# EasyEDA Pro project ProPrj_Gochizo_V2.4.epro

# Schematic Schematic

## Sheets
1 MCU: Board Name: Gochizo; Create Date: 2024-09-22
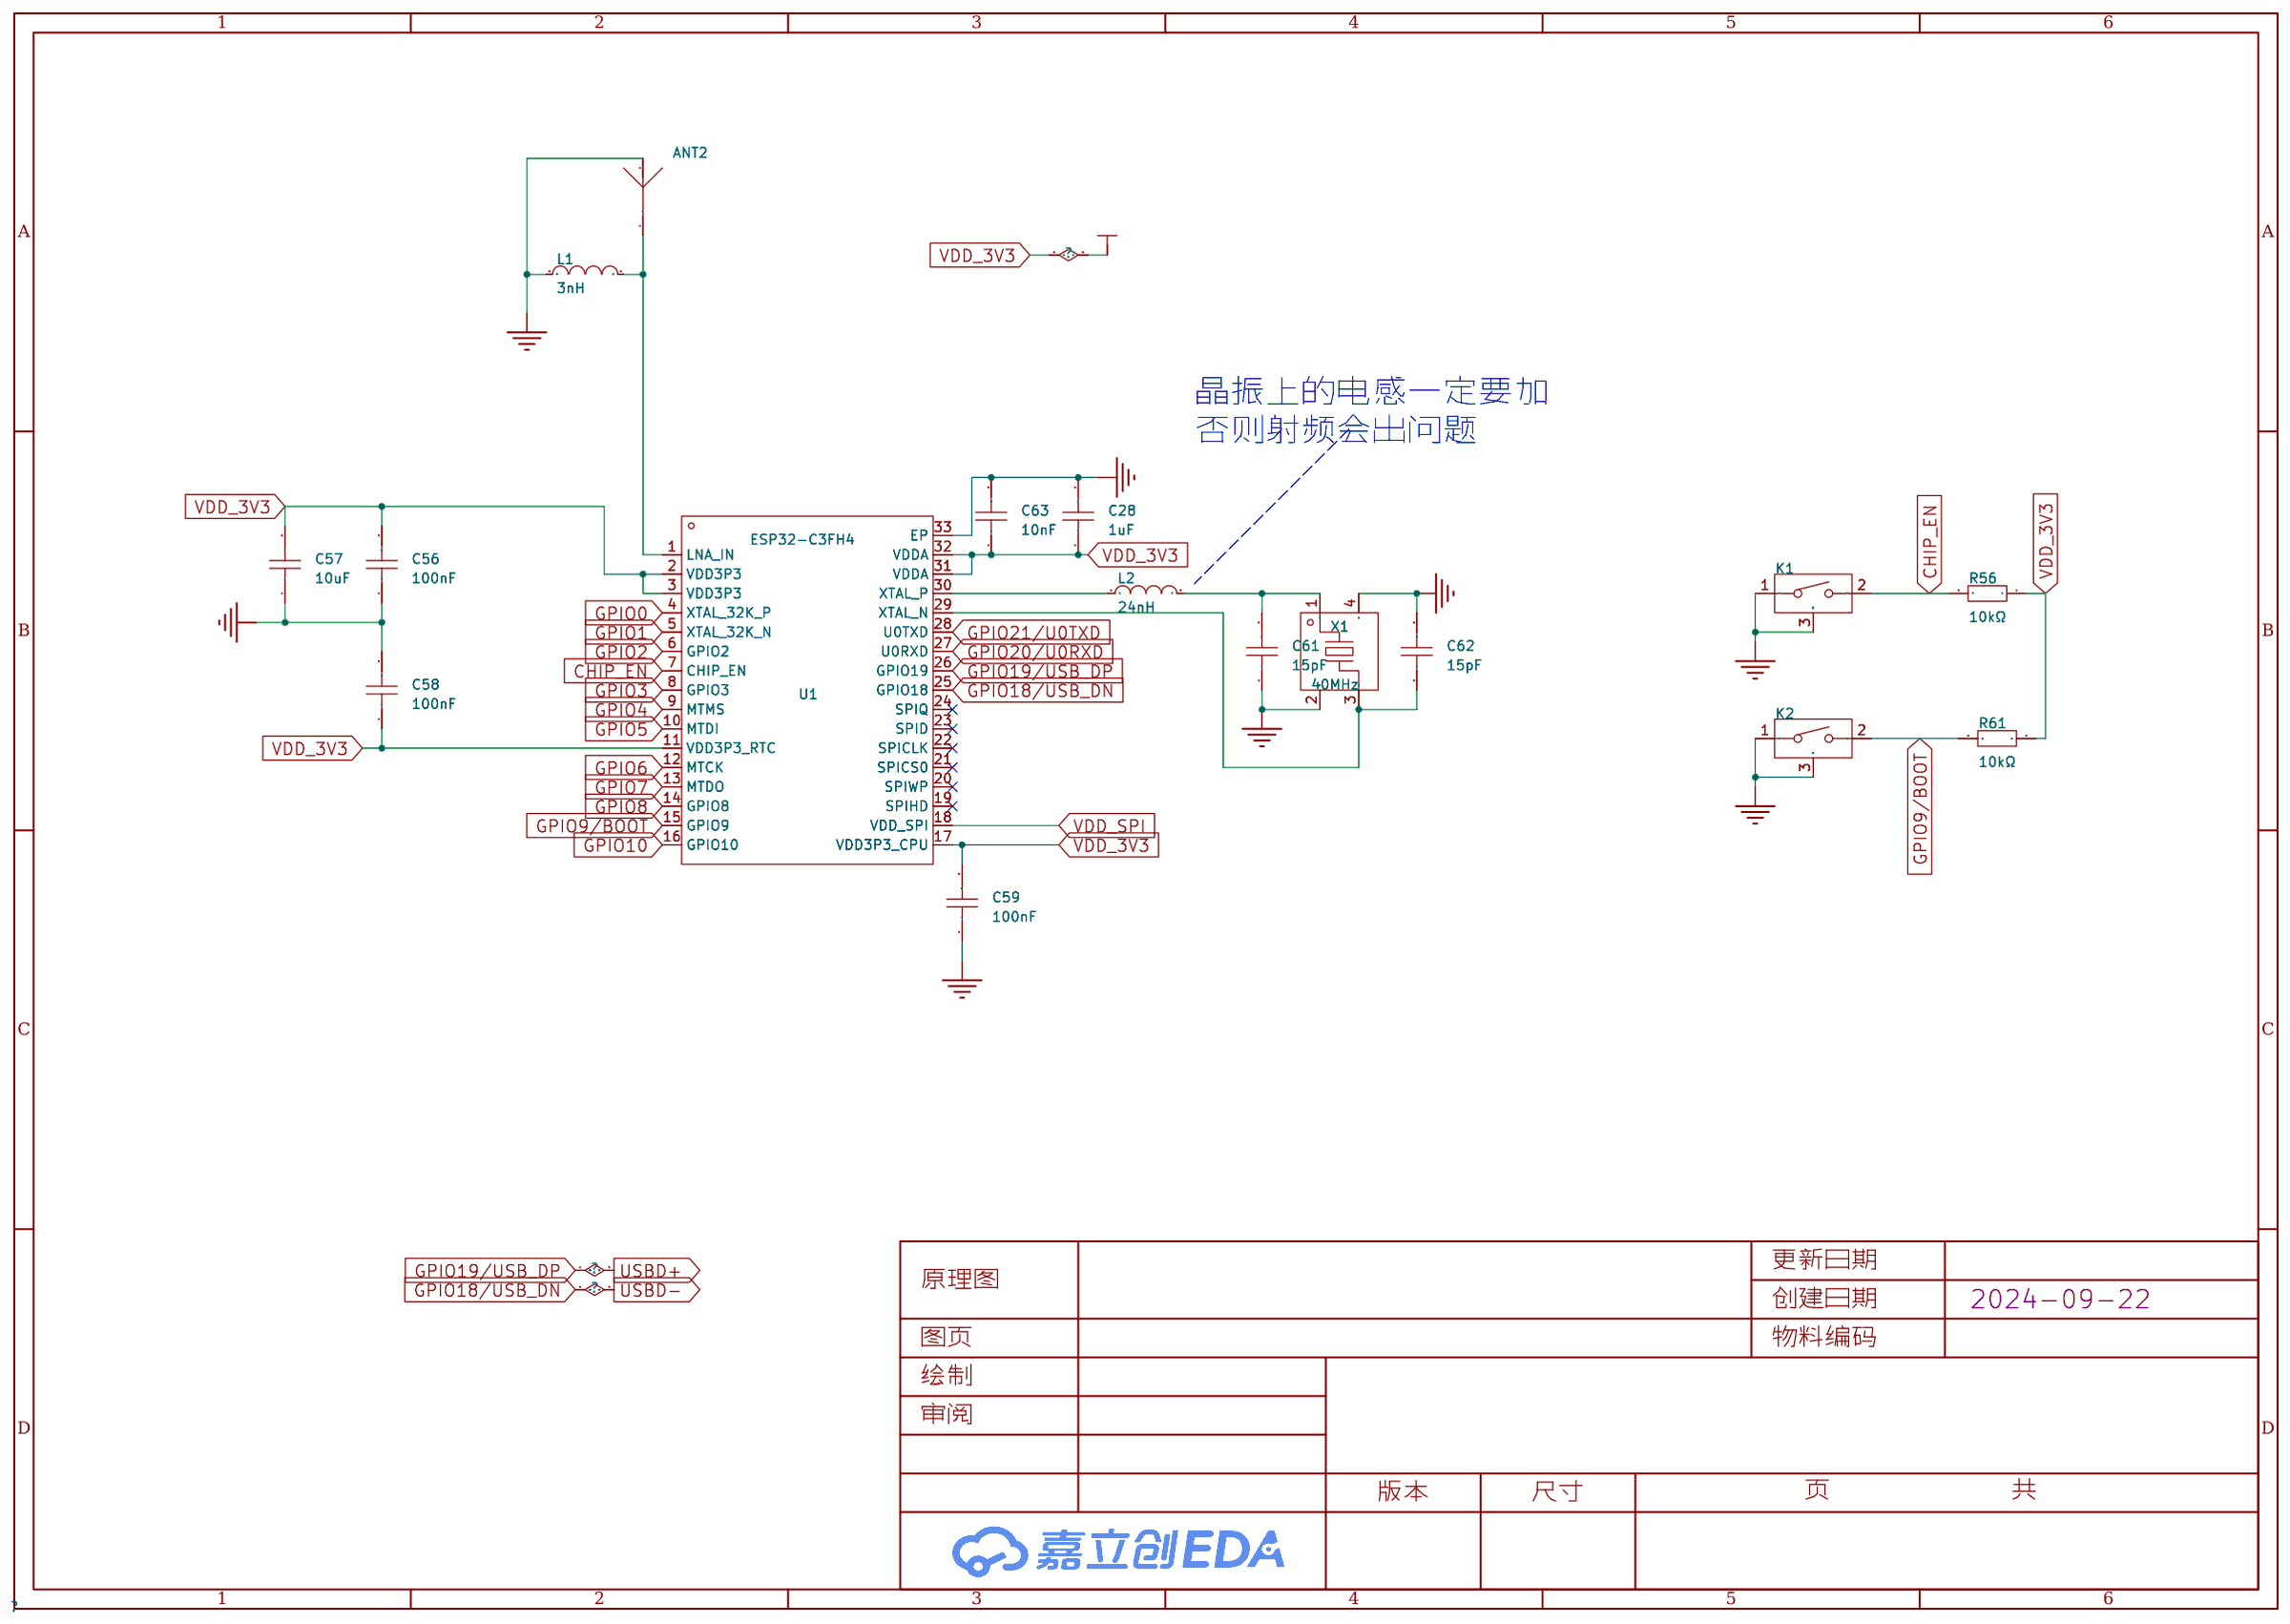
[diagram p0: MCU]
2 PWR
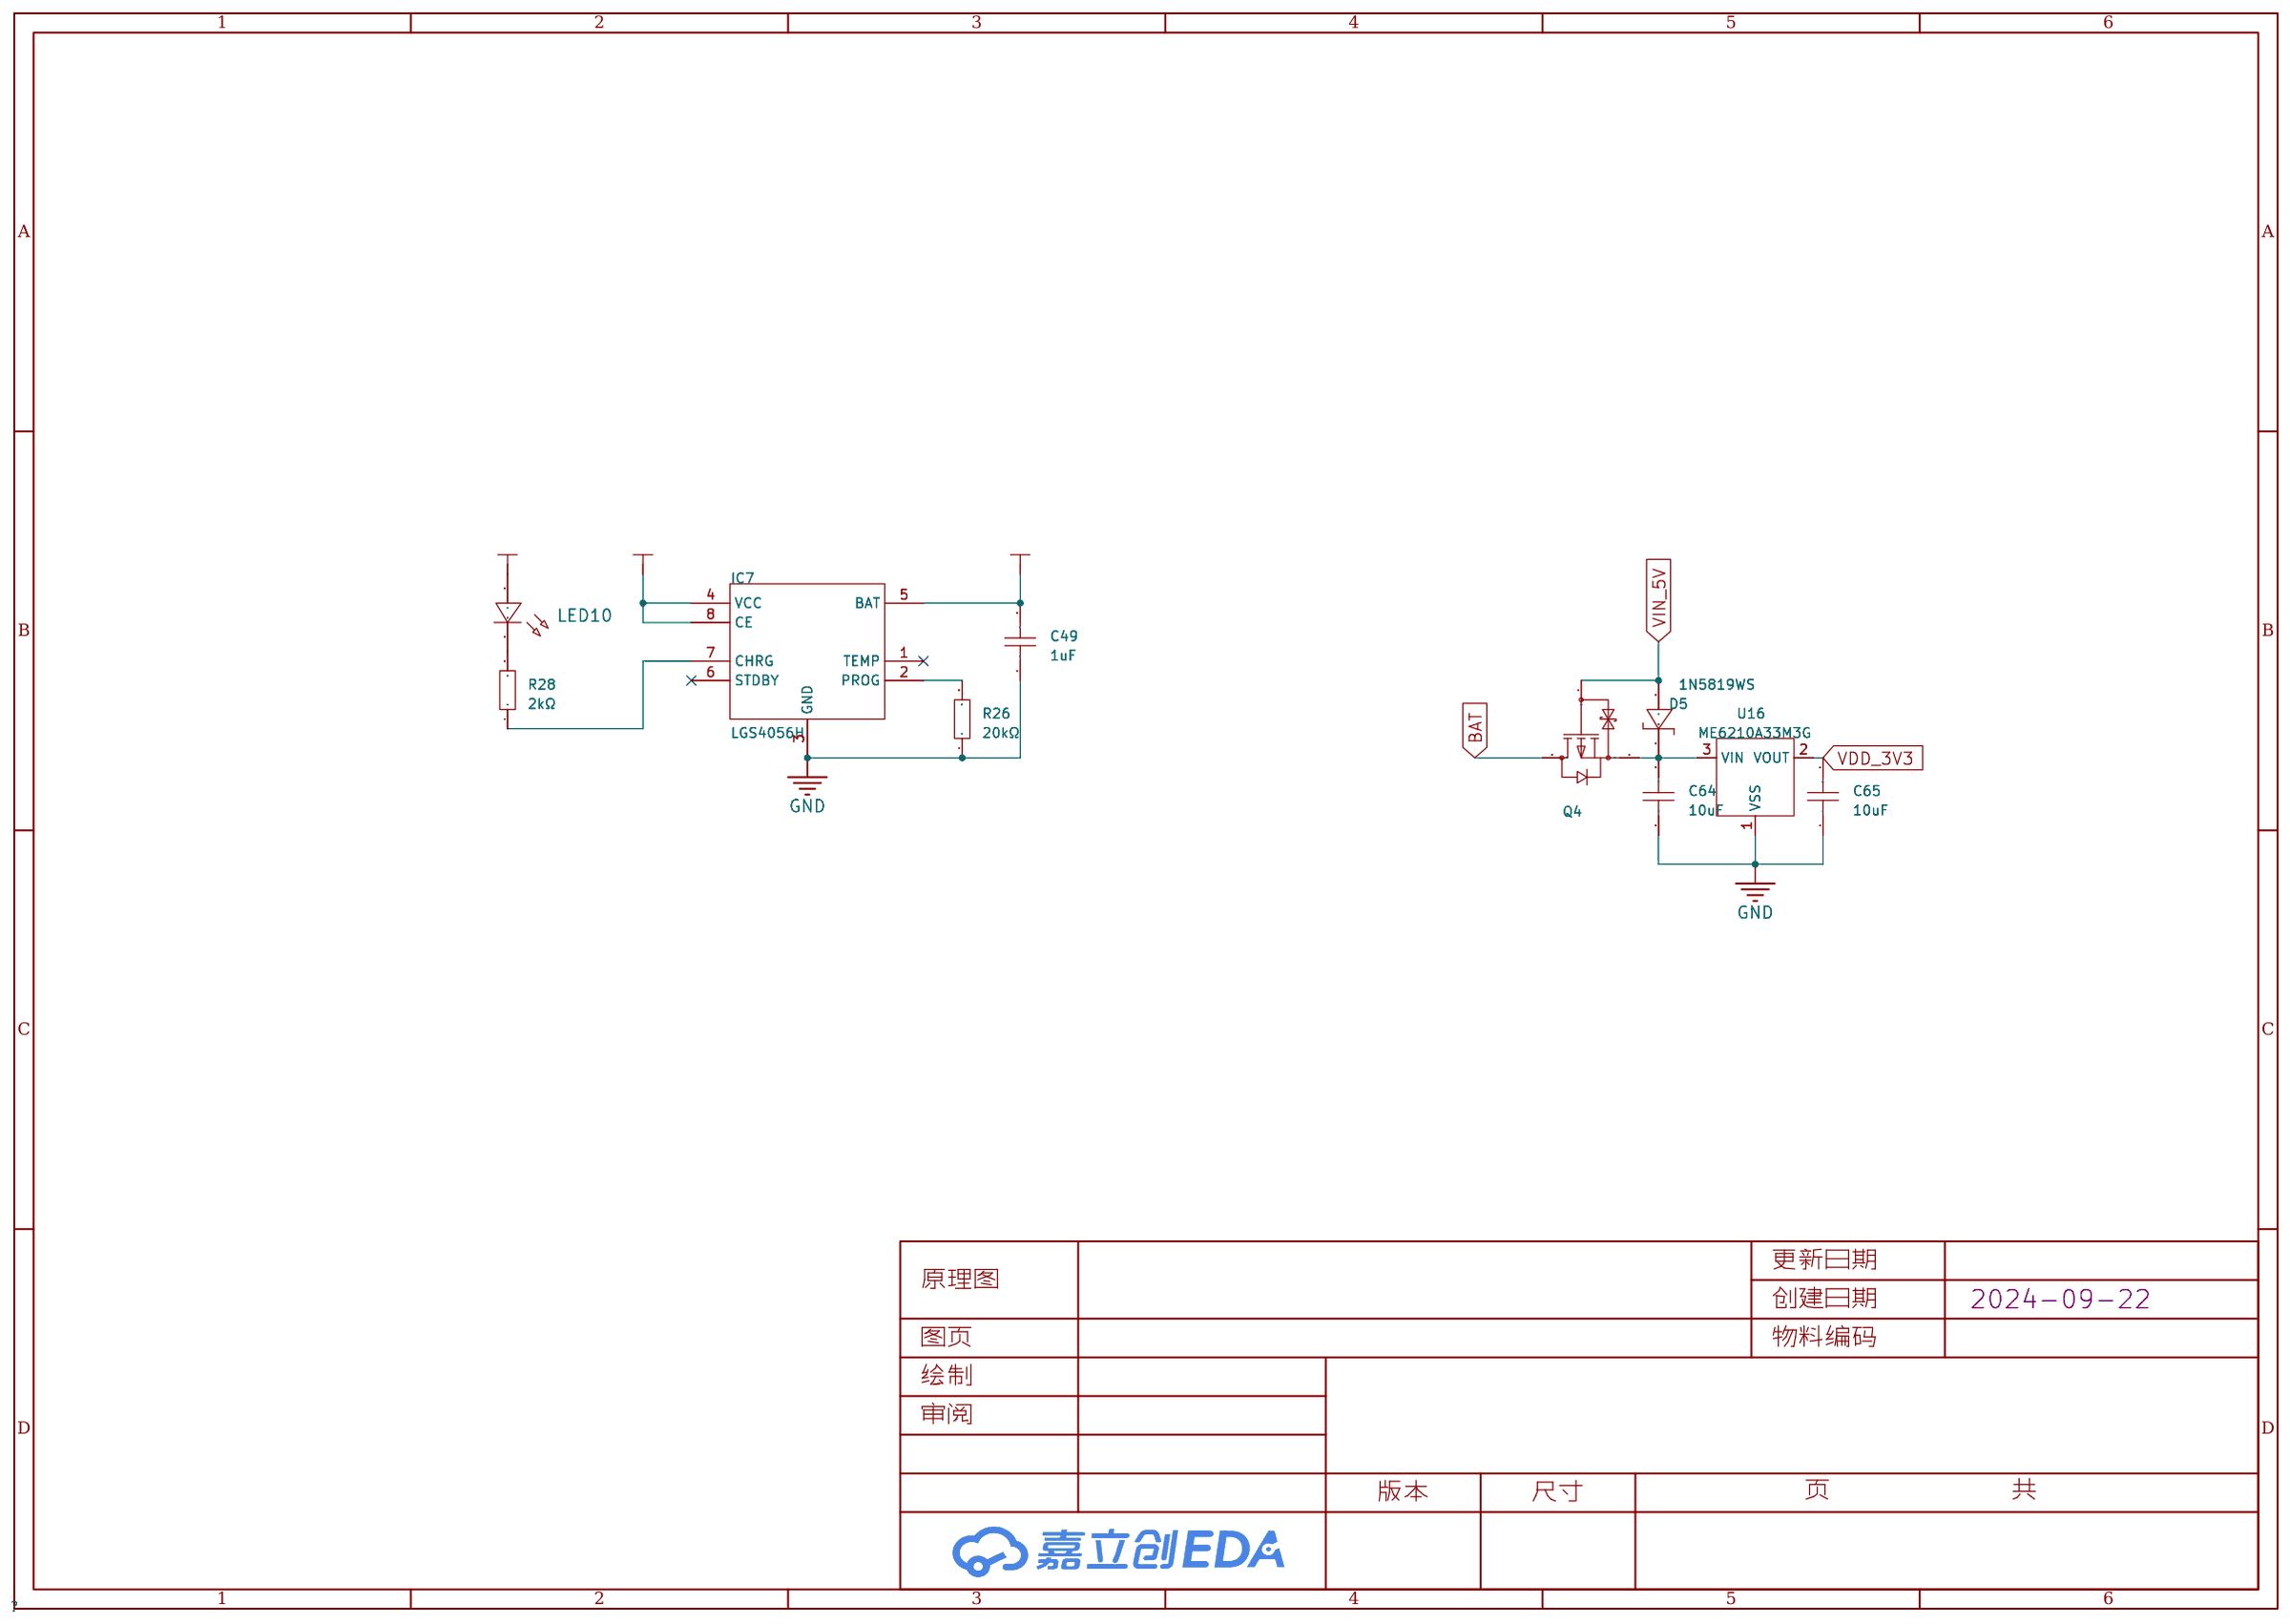
[diagram p1: PWR]
3 USER
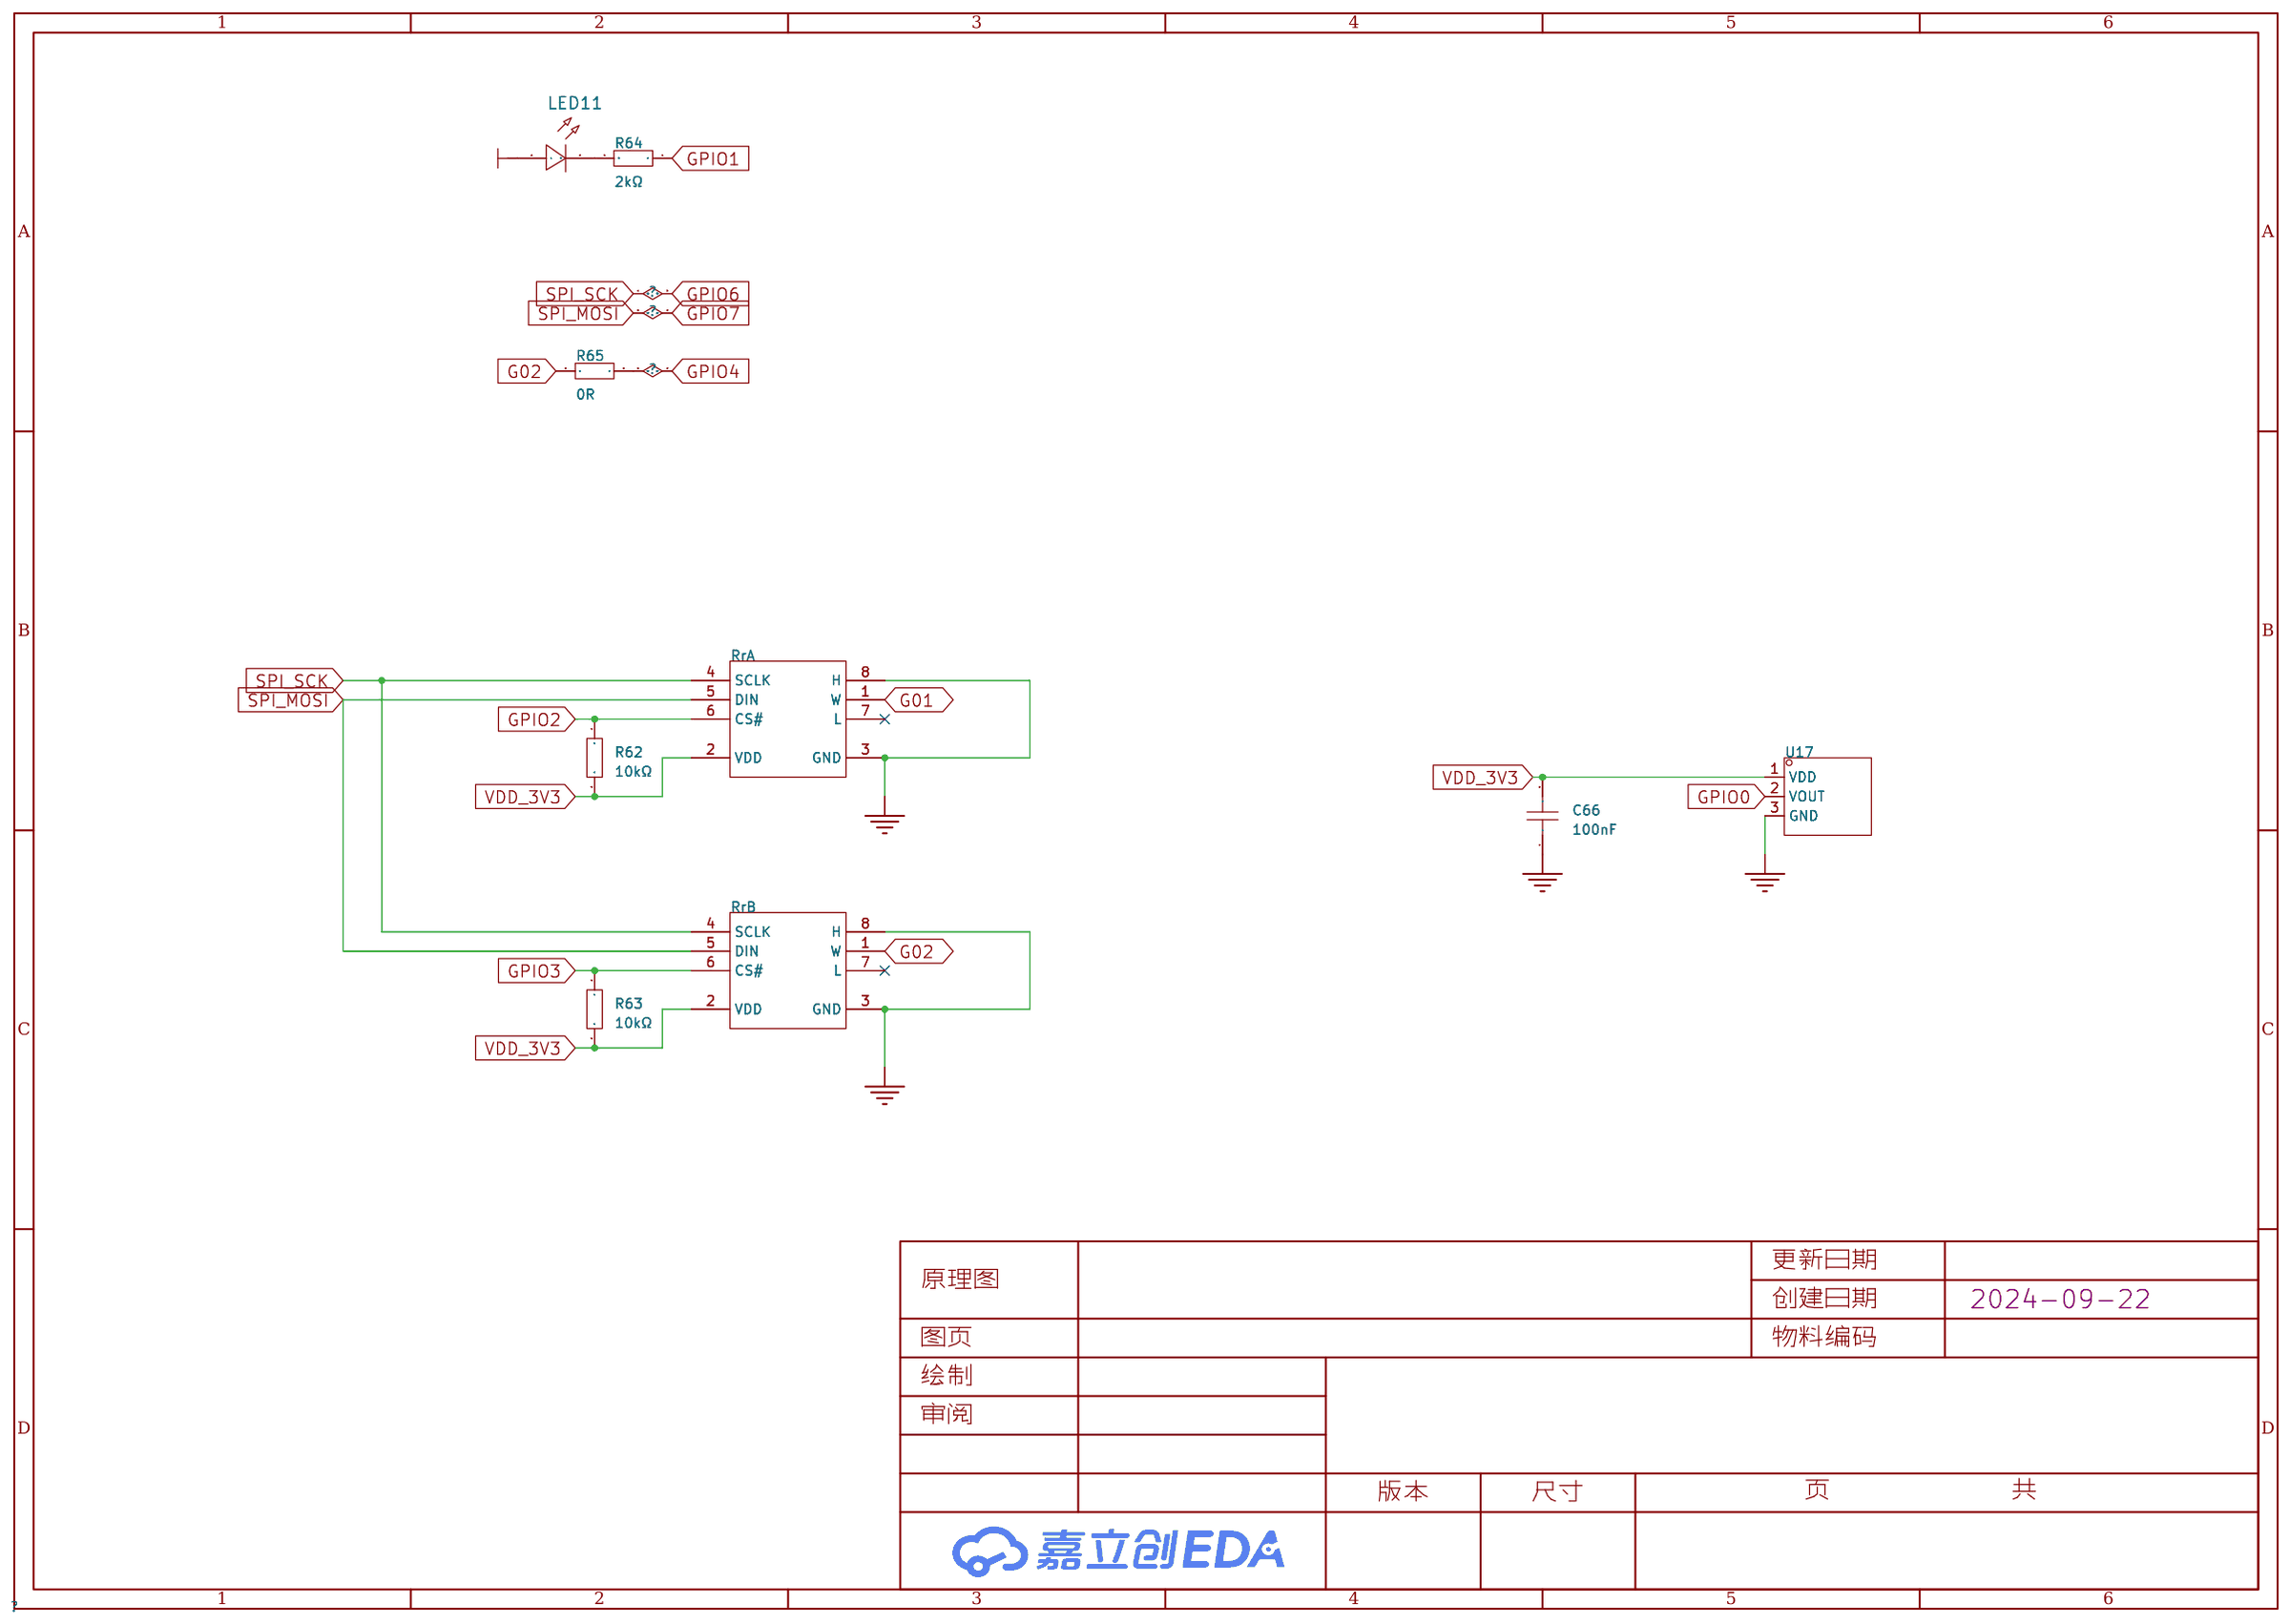
[diagram p2: USER]

## Parts
sheet MCU
ANT2  -  [ANT-SMD_L3.2-W1.6_CA-C01]
C28  1uF  [C0402]
C56  100nF  [C0402]
C57  10uF  [C0402]
C58  100nF  [C0402]
C59  100nF  [C0402]
C61  15pF  [C0402]
C62  15pF  [C0402]
C63  10nF  [C0402]
K1  TS3819ZJ 160gf  [KEY-SMD_TS3819ZJ]
K2  TS3819ZJ 160gf  [KEY-SMD_TS3819ZJ]
L1  3nH  [L0201]
L2  24nH  [IND-SMD_L1.0-W0.5-2]
R56  10kΩ  [R0402]
R61  10kΩ  [R0402]
U1  ESP32-C3FH4  [QFN-32_L5.0-W5.0-P0.50-TL-EP3.7]
X1  40MHz  [CRYSTAL-SMD_4P-L2.0-W1.6-BL]
sheet PWR
C49  1uF  [C0402]
C64  10uF  [C0402]
C65  10uF  [C0402]
D5  1N5819WS  [sod-323_l1.8-w1.3-ls2.5-rd]
IC7  LGS4056H  [DFN-8_L2.0-W2.0-P0.50-TL-EP]
LED10  LED0402-红色  [LED0402-RD_RED]
Q4  CJE3139K  [SC-75-3_L1.6-W0.8-P1.00-LS1.7-BR]
R26  20kΩ  [R0402]
R28  2kΩ  [R0402]
U16  ME6210A33M3G  [SOT-23-3_L3.0-W1.7-P0.95-LS2.9-BR]
sheet USER
C66  100nF  [C0402]
LED11  LED0402-红色  [LED0402-RD_RED]
R62  10kΩ  [R0402]
R63  10kΩ  [R0402]
R64  2kΩ  [R0402]
R65  0R  [R0402]
RrA  TPL0501-100DCNR  [SOT-23-8_L3.0-W1.7-P0.65-LS2.8-BL]
RrB  TPL0501-100DCNR  [SOT-23-8_L3.0-W1.7-P0.65-LS2.8-BL]
U17  CC6201ST  [SOT-23-3_L2.9-W1.3-P1.90-LS2.4-BR]

## Library data of the parts
ANT2 = CA-C01: Supplier Part: C9900018999; Supplier Footprint: SMD_3.2x1.6x0.4mm; JLCPCB Part Class: ExtendedPart; Datasheet: https://atta.szlcsc.comnull; Supplier: LCSC
C28 C56-C59 C61-C66 = CL05B104KB54PNC: 容值:100nF;精度:±10%;额定电压:50V;材质(温度系数):X7R;; LCSC Part Name: 100nF ±10% 50V; Supplier Part: C307331; Manufacturer: SAMSUNG(三星); Supplier Footprint: 0402; JLCPCB Part Class: 基础库; Datasheet: https://atta.szlcsc.com/upload/public/pdf/source/20181009/C307331_222F7C870FD3EA5F46F538B483443886.pdf; Supplier: LCSC; Tolerance: ±10%; Voltage Rated: 50V; Temperature Coefficient: X7R
K1 K2 = TS3819ZJ 160gf: 电路结构:单刀单掷;按钮形状:圆形按钮;作用力:1.6N;安装方式:卧贴;开关长度:3.9mm;开关宽度:2.9mm;开关高度:1.6mm;带支架:不带;触点电流:50mA;额定电压(DC):12V;绝缘电阻:100MΩ;带灯:无;机械寿命:50万次;; LCSC Part Name: 3.9*2.9*1.6mm 侧贴 3.8*1.9支架; Supplier Part: C6386917; Manufacturer: SHOU HAN(首韩); Supplier Footprint: SMD; JLCPCB Part Class: 扩展库; Datasheet: https://atta.szlcsc.com/upload/public/pdf/source/20230523/2451218DE4EE3321D1269CDEBC6584AD.pdf; Supplier: LCSC; Circuit: 单刀单掷; Actuator Style: 圆形按钮; Operating Force: 1.6N; Mounting Style: 卧贴; Switch Length: 3.9mm; Switch Width: 2.9mm; Switch Height: 1.6mm; Strike Gundam: 不带; Contact Current: 50mA; Voltage Rating (DC): 12V; Insulation Resistance: 100MΩ; Actuator/Cap Color: 白色; With Lamp: 无; Mechanical Life: 50万次; Operating Temperature: -30℃~+85℃
L1 = LQP03TN3N0B02D: 电感值:3nH;额定电流:-;饱和电流(Isat):-;直流电阻(DCR):250mΩ;; LCSC Part Name: 3nH ±0.1nH; Supplier Part: C98044; Manufacturer: muRata(村田); Supplier Footprint: 0201; JLCPCB Part Class: Extended Part; Datasheet: https://atta.szlcsc.com/upload/public/pdf/source/20170310/1489116404591.pdf; Supplier: LCSC; DC Resistance (DCR): 250mΩ; Q @ Freq: 14@500MHz; Frequency - Self Resonant: 9.5GHz
L2 = LQW15AN24NG80D: 电感值:24nH;精度:±2%;额定电流:770mA;饱和电流(Isat):-;; LCSC Part Name: 24nH ±2%; Supplier Part: C668462; Manufacturer: muRata(村田); Supplier Footprint: 0402; JLCPCB Part Class: 扩展库; Datasheet: https://atta.szlcsc.com/upload/public/pdf/source/20201228/C668462_EF8FB8FB445A38E861DA03D3842BC057.pdf; Supplier: LCSC; Tolerance: ±2%; Rated Current: 770mA; DC Resistance (DCR): 212mΩ
R56 R61-R63 R65 = 0402WGF1002TCE: 阻值:10kΩ;精度:±1%;功率:62.5mW;温度系数:±100ppm/℃;电阻类型:厚膜电阻;; LCSC Part Name: 10kΩ ±1% 62.5mW 厚膜电阻; Supplier Part: C25744; Manufacturer: UNI-ROYAL(厚声); Supplier Footprint: 0402; JLCPCB Part Class: Basic Part; Datasheet: https://atta.szlcsc.com/upload/public/pdf/source/20200306/C422600_1E6D84923E4A46A82E41ADD87F860B5C.pdf; Supplier: LCSC; Tolerance: ±1%; Power(Watts): 62.5mW; Overload Voltage (Max): 50V; Temperature Coefficient: ±100ppm/℃; Type: 厚膜电阻; Operating Temperature Range: -55℃~+155℃
U1 = ESP32-C3FH4: Supplier Part: C2858491; Manufacturer: ESPRESSIF(乐鑫); Supplier Footprint: QFN-32; JLCPCB Part Class: Extended Part; Datasheet: https://atta.szlcsc.com/upload/public/pdf/source/20210726/B8823F05EB5B1ECA99D4F01661A43FA8.pdf; Supplier: LCSC
X1 = 7D040000I01: 频率:40MHz;频率公差:±10ppm;频率稳定度:±20ppm;负载电容:10pF;; LCSC Part Name: 40MHz ±10ppm 内置负载电容:10pF; Supplier Part: C648973; Manufacturer: HD(浩都频率); Supplier Footprint: SMD2016-4P; JLCPCB Part Class: 扩展库; Datasheet: https://atta.szlcsc.com/upload/public/pdf/source/20220223/118C2648083ADD7FA58C5549E27EC941.pdf; Supplier: LCSC; Crystal Type: 贴片无源晶振; Frequency Tolerance: ±10ppm; Frequency Stability: ±20ppm; Load Capacitance: 10pF
C49 = GRM155R61E105KA12D: 容值:1uF;精度:±10%;额定电压:25V;材质(温度系数):X5R;; LCSC Part Name: 1uF±10%25V; Supplier Part: C77009; Manufacturer: muRata(村田); Supplier Footprint: 0402; JLCPCB Part Class: ExtendedPart; Datasheet: https://atta.szlcsc.com/upload/public/pdf/source/20180326/C77009_C84F63FC30571BAC77C5C818267378FE.pdf; Supplier: LCSC; Tolerance: ±10%; Voltage Rated: 25V; Temperature Coefficient: X5R
D5 = 1N5819WS_C191023: 直流反向耐压(Vr):40V;平均整流电流(Io):1A;正向压降(Vf):600mV@1A;; LCSC Part Name: 40V 1A 600mV@1A; Supplier Part: C191023; Manufacturer: Hottech(合科泰); Supplier Footprint: SOD-323; JLCPCB Part Class: Basic Part; Datasheet: https://atta.szlcsc.com/upload/public/pdf/source/20180614/C191023_3C6A6398B911F3A4C23E7538EE054643.pdf; Supplier: LCSC; Reverse Voltage (Vr): 40V; Average Rectified Current (Io): 1A; Forward Voltage (Vf@If): 600mV@1A
IC7 = LGS4056HDA: LCSC Part Name: C5124109
LED10 LED11 = LED0402-红色: Supplier Part: C9900023317; Supplier Footprint: LED_0402_RED; JLCPCB Part Class: ExtendedPart; Datasheet: https://atta.szlcsc.comnull; Supplier: LCSC
Q4 = CJE3139K: 类型:P沟道;漏源电压(Vdss):20V;连续漏极电流(Id):660mA;功率(Pd):150mW;导通电阻(RDS(on)@Vgs,Id):520mΩ@4.5V,1A;阈值电压(Vgs(th)@Id):1.1V@250μA;; LCSC Part Name: P沟道20V660mA; Supplier Part: C70991; Manufacturer: CJ（江苏长电/长晶）; Supplier Footprint: SC-75(SOT-523); JLCPCB Part Class: ExtendedPart; Datasheet: https://atta.szlcsc.com/upload/public/pdf/source/20160416/1460799392748.pdf; Supplier: LCSC; Type: P沟道; Drain Source Voltage (Vdss): 20V; Continuous Drain Current (Id): 660mA; Power Dissipation (Pd): 150mW; Drain Source On Resistance (RDS(on)@Vgs,Id): 520mΩ@4.5V,1A; Gate Threshold Voltage (Vgs(th)@Id): 1.1V@250μA
R26 = 0402WGF2002TCE: 电阻类型:厚膜电阻;阻值:20kΩ;精度:±1%;功率:62.5mW;; LCSC Part Name: 20kΩ±1%62.5mW; Supplier Part: C25765; Manufacturer: UNI-ROYAL(厚声); Supplier Footprint: 0402; JLCPCB Part Class: BasicPart; Datasheet: https://atta.szlcsc.com/upload/public/pdf/source/20200306/C422600_1E6D84923E4A46A82E41ADD87F860B5C.pdf; Supplier: LCSC; Type: 厚膜电阻; Tolerance: ±1%; Power(Watts): 62.5mW; Temperature Coefficient: ±100ppm/℃; Overload Voltage (Max): 50V; Operating Temperature Range: -55℃~+155℃
R28 R64 = 0402WGF2001TCE: 电阻类型:厚膜电阻;阻值:2kΩ;精度:±1%;功率:62.5mW;; LCSC Part Name: 2kΩ±1%62.5mW; Supplier Part: C4109; Manufacturer: UNI-ROYAL(厚声); Supplier Footprint: 0402; JLCPCB Part Class: BasicPart; Datasheet: https://atta.szlcsc.com/upload/public/pdf/source/20200306/C422600_1E6D84923E4A46A82E41ADD87F860B5C.pdf; Supplier: LCSC; Type: 厚膜电阻; Tolerance: ±1%; Power(Watts): 62.5mW; Temperature Coefficient: ±100ppm/℃; Overload Voltage (Max): 50V; Operating Temperature Range: -55℃~+155℃
U16 = ME6210A33M3G: 输出类型:固定;输出极性:正;最大输入电压:18V;输出电压:3.3V;输出电流:500mA;电源纹波抑制比(PSRR):-;; LCSC Part Name: 正 Vin=18V Vout=3.3V 500mA; Supplier Part: C236680; Manufacturer: MICRONE(南京微盟); Supplier Footprint: SOT-23; JLCPCB Part Class: Extended Part; Datasheet: https://atta.szlcsc.com/upload/public/pdf/source/20180709/C236680_4A9EFC836B6D96276770F83E6DC5A093.pdf; Supplier: LCSC; Output Type: 固定; Output Polarity: 正; Number of Outputs: 1; Maximum Input Voltage: 18V; Output Voltage: 3.3V; Dropout Voltage: 260mV@(200mA); Output Current: 500mA
RrA RrB = TPL0501-100DCNR: 电阻值(欧姆):100kΩ;接口类型:SPI;供电电压:2.7V~5.5V;精度:±20%;; Supplier Part: C131323; Manufacturer: TI(德州仪器); Supplier Footprint: SOT-23-8; JLCPCB Part Class: 扩展库; Datasheet: https://www.ti.com/cn/lit/gpn/tpl0501-100; Supplier: LCSC; Resistance Value (Ohms): 100kΩ; Number of Taps: 256; Interface Type: SPI; Number of Channels: 1; Supply Voltage: 2.7V~5.5V; Precision: ±20%; Temperature Coefficient (Typ): 35ppm/℃; Operating Temperature: -40℃~+125℃
U17 = CC6201ST: 微功耗   全极型微功耗霍尔效应开关; LCSC Part Name: 霍尔效应开关; Supplier Part: C285995; Manufacturer: CrossChip(成都芯进); Supplier Footprint: TSOT-23-3; JLCPCB Part Class: 扩展库; Datasheet: https://atta.szlcsc.com/upload/public/pdf/source/20180919/C285996_9641046DC0D68E54233000F429BA026E.pdf; Supplier: LCSC

## Nets
3V3: C28.1 C56.2 C57.2 C58.1 C59.2 C63.1 C65.2 C66.2 LED11.2(A) R56.1 R61.1 R62.2 R63.2 RrA.2(VDD) RrB.2(VDD) U1.2(VDD3P3) U1.3(VDD3P3) U1.11(VDD3P3_RTC) U1.17(VDD3P3_CPU) U1.31(VDDA) U1.32(VDDA) U16.2(VOUT) U17.1(VDD)
GND: ANT2.2 C28.2 C49.1 C56.1 C57.1 C58.2 C59.1 C61.1 C62.2 C63.2 C64.1 C65.1 C66.1 IC7.3(GND) K1.1 K1.3(GND) K2.1 K2.3(GND) L1.2 R26.1 RrA.3(GND) RrA.8(H) RrB.3(GND) RrB.8(H) U1.33(EP) U16.1(VSS) U17.3(GND) X1.2(GND) X1.4(GND)
VDD_SPI: U1.18(VDD_SPI)
VIN_5V: D5.2(A) IC7.4(VCC) IC7.8(CE) LED10.2(A) Q4.1(G)
BAT: C49.2 IC7.5(BAT) Q4.3(D)
CHIP_EN: K1.2 R56.2 U1.7(CHIP_EN)
G01: RrA.1(W)
G02: R65.1 RrB.1(W)
GPIO0: U1.4(XTAL_32K_P) U17.2(VOUT)
GPIO1: R64.1 U1.5(XTAL_32K_N)
GPIO2: R62.1 RrA.6(CS#) U1.6(GPIO2)
GPIO3: R63.1 RrB.6(CS#) U1.8(GPIO3)
GPIO4: R65.2 U1.9(MTMS)
GPIO5: U1.10(MTDI)
GPIO6: RrA.4(SCLK) RrB.4(SCLK) U1.12(MTCK)
GPIO7: RrA.5(DIN) RrB.5(DIN) U1.13(MTDO)
GPIO8: U1.14(GPIO8)
GPIO9/BOOT: K2.2 R61.2 U1.15(GPIO9)
GPIO10: U1.16(GPIO10)
GPIO18/USB_DN: U1.25(GPIO18)
GPIO19/USB_DP: U1.26(GPIO19)
GPIO20/U0RXD: U1.27(U0RXD)
GPIO21/U0TXD: U1.28(U0TXD)
$1N988: C61.2 L2.2 X1.1
$1N989: L2.1 U1.30(XTAL_P)
$1N991: ANT2.1(ANT) L1.1 U1.1(LNA_IN)
$1N995: C62.1 U1.29(XTAL_N) X1.3
$2N303: C64.2 D5.1(C) Q4.2(S) U16.3(VIN)
$2N532: IC7.7(CHRG) R28.1
$2N535: IC7.2(PROG) R26.2
$2N537: LED10.1(C) R28.2
$3N2118: LED11.1(C) R64.2

Not connected (* = marked no-connect by the designer): IC7 1(TEMP)* 6(STDBY)*; RrA 7(L)*; RrB 7(L)*; U1 19(SPIHD)* 20(SPIWP)* 21(SPICS0)* 22(SPICLK)* 23(SPID)* 24(SPIQ)*

## Notes on the sheets
sheet 1
- 晶振上的电感一定要加
  否则射频会出问题

# Board Gochizo_V2.4
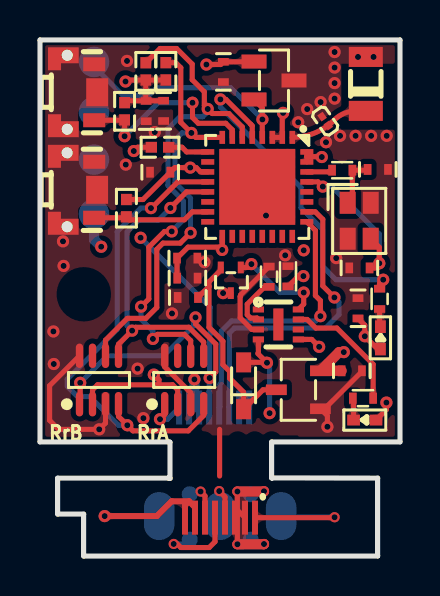
[diagram p3: board, top side]
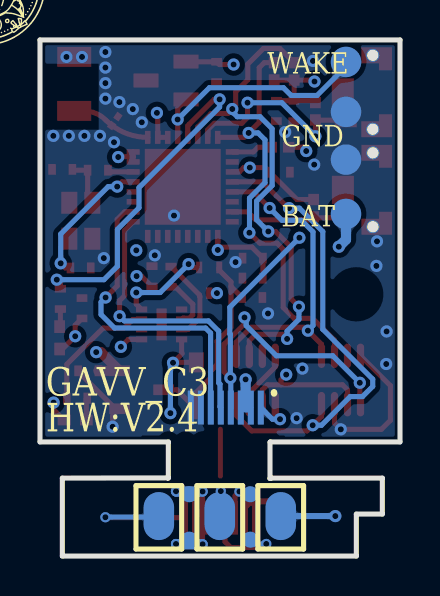
[diagram p4: board, bottom side, seen from below]

Outline 18 x 25.83 mm; copper layers: Top Layer, 电源, 地, Bottom Layer. Coordinates in mm from the lower left corner of the outline.
Outline path: 6.51,3.88 6.46,3.93 6.43,3.9 0.88,3.9 0.88,2.1 2.18,2.1 2.18,0 16.88,0 16.88,3.9 11.58,3.91 11.58,5.71 18,5.71 18,25.83 0,25.83 0,5.71 6.48,5.71 6.5,5.69 6.5,3.89 ; 11.58,3.92 11.61,3.89
Stack: Top Layer 0.035mm 外层铜厚1oz / Dielectric1 0.2104mm 7628 RC49% 8.6mil / 电源 0.0152mm 内层铜厚 / Dielectric2 1.065mm 1.1mm H/HOZ Copper / 地 0.0152mm 内层铜厚 / Dielectric3 0.2104mm 7628 RC49% 8.6mil / Bottom Layer 0.035mm 外层铜厚1oz

## Design rules (mm)
template: 自定义配置
spacing copperThickness1oz (default): track to track 0.102, other pairs 0 to 0.3
spacing copperThickness2oz: track to track 0.203, other pairs 0.152 to 0.3
track width copperThickness1oz (default): min 0.127, default 0.254, max 2.54
track width copperThickness2oz: min 0.203, default 0.254, max 2.54
differential pair differentialPair (default): width min 0.127, default 0.254, max 2.54; gap min 0.152, default 0.152
via viaSize (default): diameter min 0.5, default 0.61, max 10; hole min 0.3, default 0.305, max 6.3

## Placement (name value [footprint] x y rotation side)
ANT2  -  [ANT-SMD_L3.2-W1.6_CA-C01]  16.29 23.63 90 top
C28  1uF  [C0402]  5.31 22.27 270 top
C49  1uF  [C0402]  12.4 14 270 top
C56  100nF  [C0402]  6.01 19.21 0 top
C57  10uF  [C0402]  7.37 13.91 180 top
C58  100nF  [C0402]  15.9 12.4 90 top
C59  100nF  [C0402]  7.36 14.91 180 top
C61  15pF  [C0402]  16.89 19.35 180 top
C62  15pF  [C0402]  15.97 14.42 180 top
C63  10nF  [C0402]  6.18 22.28 270 top
C64  10uF  [C0402]  7.39 12.94 0 top
C65  10uF  [C0402]  15.59 9.27 180 top
C66  100nF  [C0402]  9.17 24.23 90 top
D5  1N5819WS  [sod-323_l1.8-w1.3-ls2.5-rd]  10.18 8.52 90 top
IC7  LGS4056H  [DFN-8_L2.0-W2.0-P0.50-TL-EP]  11.92 11.59 0 top
K1  TS3819ZJ 160gf  [KEY-SMD_TS3819ZJ]  2.01 23.21 180 top
K2  TS3819ZJ 160gf  [KEY-SMD_TS3819ZJ]  2.01 18.33 180 top
L1  3nH  [L0201]  14.26 21.77 125 top
L2  24nH  [IND-SMD_L1.0-W0.5-2]  15.11 19.31 0 top
LED10  LED0402-红色  [LED0402-RD_RED]  16.24 6.81 0 top
LED11  LED0402-红色  [LED0402-RD_RED]  17.02 10.92 270 top
NOREF  -  [Pad_e670]  2.7 24.73 270 top
NOREF#2  -  [Pad_e694]  2.7 19.84 90 top
NOREF#3  -  [Pad_e513]  10.46 7.43 0 top
NOREF#4  -  [Pad_e86]  10.53 3.09 180 top
NOREF#5  -  [Pad_e177]  10.25 1.92 180 top
NOREF#6  -  [Pad_e514]  9.96 7.43 0 top
NOREF#7  -  [Pad_e175]  9.25 1.92 180 top
NOREF#8  -  [Pad_e173]  8.25 1.92 180 top
NOREF#9  -  [Pad_e171]  7.25 1.92 180 top
NOREF#10  -  [Pad_e123]  7.49 0.82 180 top
NOREF#11  -  [Pad_e521]  7.96 7.43 0 top
NOREF#12  -  [Pad_e695]  2.7 17.12 270 top
NOREF#13  -  [Pad_e178]  10.75 1.92 180 top
NOREF#14  -  [Pad_e87]  10.53 0.82 180 top
NOREF#15  -  [Pad_e172]  7.75 1.92 180 top
NOREF#16  -  [Pad_e77]  9.01 2 180 top
NOREF#17  -  [Pad_e517]  8.96 7.43 0 top
NOREF#18  -  [Pad_e176]  9.75 1.92 180 top
NOREF#19  -  [Pad_e515]  9.46 7.43 0 top
NOREF#20  -  [Pad_e174]  8.75 1.92 180 top
NOREF#21  -  [Pad_e520]  8.46 7.43 0 top
NOREF#22  -  [Pad_e523]  7.46 7.43 0 top
NOREF#23  -  [Pad_e76]  5.96 2 180 top
NOREF#24  -  [Pad_e114]  7.49 3.09 180 top
NOREF#25  -  [Pad_e78]  12.06 2 180 top
NOREF#26  -  [Pad_e671]  2.7 22.23 270 top
NOREF#27  -  [Pad_e524]  6.96 7.43 0 top
Q4  CJE3139K  [SC-75-3_L1.6-W0.8-P1.00-LS1.7-BR]  9.54 13.8 90 top
R26  20kΩ  [R0402#2]  11.45 13.98 270 top
R28  2kΩ  [R0402#2]  16.15 7.9 180 top
R56  10kΩ  [R0402]  4.23 22.26 270 top
R61  10kΩ  [R0402]  4.32 17.41 270 top
R62  10kΩ  [R0402]  5.29 24.26 270 top
R63  10kΩ  [R0402]  6.29 24.26 270 top
R64  2kΩ  [R0402#2]  16.98 12.87 270 top
R65  0R  [R0402]  6 20.46 0 top
RrA  TPL0501-100DCNR  [SOT-23-8_L3.0-W1.7-P0.65-LS2.8-BL]  7.21 8.81 0 top
RrB  TPL0501-100DCNR  [SOT-23-8_L3.0-W1.7-P0.65-LS2.8-BL]  2.95 8.81 0 top
U1  ESP32-C3FH4  [QFN-32_L5.0-W5.0-P0.50-TL-EP3.7]  10.86 18.48 270 top
U16  ME6210A33M3G  [SOT-23-3_L3.0-W1.7-P0.95-LS2.9-BR]  12.92 8.32 0 top
U17  CC6201ST  [SOT-23-3_L2.9-W1.3-P1.90-LS2.4-BR]  11.7 23.8 180 top
X1  40MHz  [CRYSTAL-SMD_4P-L2.0-W1.6-BL]  15.96 16.78 270 top

## Footprints (pads in the part's own frame, mm; a bottom-side part is the same pattern mirrored in y, then rotated)
ANT-SMD_L3.2-W1.6_CA-C01
  rect 1x1.7 smd: 1(-1.35,0) 2(1.35,0)
C0402
  rect 0.381x0.559 smd: 1(-0.509,0) 2(0.507,0)
CRYSTAL-SMD_4P-L2.0-W1.6-BL
  rect 1.1x0.8 smd: 1(-0.9,-0.575) 2(0.9,-0.575) 3(0.9,0.575) 4(-0.9,0.575)
DFN-8_L2.0-W2.0-P0.50-TL-EP
  rect 0.559x0.3 smd: 1(-1,0.75) 2(-1,0.25) 3(-1,-0.25) 4(-1,-0.75) 5(1,-0.75) 6(1,-0.25) 7(1,0.25) 8(1,0.75)
  rect 0.508x1.6 smd: 9(0,0)
IND-SMD_L1.0-W0.5-2
  rect 0.381x0.54 smd: 1(-0.508,0) 2(0.508,0)
KEY-SMD_TS3819ZJ
  rect 1.1x0.7 smd: 1(-0.697,-1.4) 2(-0.697,1.4)
  rect 1.1x1.4 smd: 3(-0.846,0)
  round 0.65 hole 0.55: 3(0.653,-1.85) 3(0.654,1.85)
  custom 1.535x1.15 smd: 3(0.846,1.675) 3(0.846,-1.675)
L0201
  rect 0.368x0.324 smd: 1(-0.275,0) 2(0.275,0)
LED0402-RD_RED
  rect 0.635x0.54 smd: 1(-0.559,0) 2(0.559,0)
Pad_e76
  oval 1.524x2.4 smd far side: 1(0,0)
Pad_e77
  oval 1.524x2.4 smd far side: 1(0,0)
Pad_e78
  oval 1.524x2.4 smd far side: 1(0,0)
Pad_e86
  round 0.8 smd far side: 1(0,0)
Pad_e87
  round 0.8 smd far side: 1(0,0)
Pad_e114
  round 0.8 smd far side: 1(0,0)
Pad_e123
  round 0.8 smd far side: 1(0,0)
Pad_e171
  rect 0.3x1.7 smd: 1(0,0)
Pad_e172
  rect 0.3x1.7 smd: 2(0,0)
Pad_e173
  rect 0.3x1.7 smd: 3(0,0)
Pad_e174
  rect 0.3x1.7 smd: 4(0,0)
Pad_e175
  rect 0.3x1.7 smd: 5(0,0)
Pad_e176
  rect 0.3x1.7 smd: 6(0,0)
Pad_e177
  rect 0.3x1.7 smd: 7(0,0)
Pad_e178
  rect 0.3x1.7 smd: 8(0,0)
Pad_e513
  rect 0.3x1.7 smd far side: 1(0,0)
Pad_e514
  rect 0.3x1.7 smd far side: 2(0,0)
Pad_e515
  rect 0.3x1.7 smd far side: 3(0,0)
Pad_e517
  rect 0.3x1.7 smd far side: 4(0,0)
Pad_e520
  rect 0.3x1.7 smd far side: 5(0,0)
Pad_e521
  rect 0.3x1.7 smd far side: 6(0,0)
Pad_e523
  rect 0.3x1.7 smd far side: 7(0,0)
Pad_e524
  rect 0.3x1.7 smd far side: 8(0,0)
Pad_e670
  round 1.524 smd far side: 1(0,0)
Pad_e671
  round 1.524 smd far side: 1(0,0)
Pad_e694
  round 1.524 smd far side: 1(0,0)
Pad_e695
  round 1.524 smd far side: 1(0,0)
QFN-32_L5.0-W5.0-P0.50-TL-EP3.7
  rect 0.65x0.28 smd: 1(-2.478,1.75) 2(-2.478,1.25) 3(-2.478,0.75) 4(-2.478,0.25) 5(-2.478,-0.25) 6(-2.478,-0.75) 7(-2.478,-1.25) 8(-2.478,-1.75) 17(2.478,-1.75) 18(2.478,-1.25) 19(2.478,-0.75) 20(2.478,-0.25) 21(2.478,0.25) 22(2.478,0.75) 23(2.478,1.25) 24(2.478,1.75)
  rect 0.28x0.65 smd: 9(-1.75,-2.478) 10(-1.25,-2.478) 11(-0.75,-2.478) 12(-0.25,-2.478) 13(0.25,-2.478) 14(0.75,-2.478) 15(1.25,-2.478) 16(1.75,-2.478) 25(1.75,2.478) 26(1.25,2.478) 27(0.75,2.478) 28(0.25,2.478) 29(-0.25,2.478) 30(-0.75,2.478) 31(-1.25,2.478) 32(-1.75,2.478)
  rect 3.8x3.8 smd: 33(0,0)
R0402
  rect 0.566x0.54 smd: 1(-0.433,0) 2(0.433,0)
R0402#2
  rect 0.381x0.559 smd: 1(-0.508,0) 2(0.508,0)
SC-75-3_L1.6-W0.8-P1.00-LS1.7-BR
  rect 0.585x0.301 smd: 1(0.642,-0.5) 2(0.642,0.5) 3(-0.642,0)
sod-323_l1.8-w1.3-ls2.5-rd
  rect 1x0.75 smd: 1(-1.173,0) 2(1.173,0)
SOT-23-3_L2.9-W1.3-P1.90-LS2.4-BR
  rect 1.25x0.7 smd: 1(1,-0.95) 2(1,0.95) 3(-1,0)
SOT-23-3_L3.0-W1.7-P0.95-LS2.9-BR
  rect 1.038x0.532 smd: 1(1.101,-0.95) 2(1.101,0.95) 3(-1.101,0)
SOT-23-8_L3.0-W1.7-P0.65-LS2.8-BL
  oval 0.364x1.222 smd: 1(-0.975,-1.211) 2(-0.325,-1.211) 3(0.325,-1.211) 4(0.975,-1.211) 5(0.975,1.211) 6(0.325,1.211) 7(-0.325,1.211) 8(-0.975,1.211)

## Nets
3V3: C28.1 C56.2 C57.2 C58.1 C59.2 C63.1 C65.2 C66.2 LED11.2 R56.1 R61.1 R62.2 R63.2 RrA.2 RrB.2 U1.2 U1.3 U1.11 U1.17 U1.31 U1.32 U16.2 U17.1
GND: ANT2.2 C28.2 C49.1 C56.1 C57.1 C58.2 C59.1 C61.1 C62.2 C63.2 C64.1 C65.1 C66.1 IC7.3 K1.1 K1.3 K2.1 K2.3 L1.2 NOREF#2.1 NOREF#3.1 NOREF#6.2 NOREF#26.1 R26.1 RrA.3 RrA.8 RrB.3 RrB.8 U1.33 U16.1 U17.3 X1.2 X1.4
VDD_SPI: U1.18
VIN_5V: D5.2 IC7.4 IC7.8 LED10.2 NOREF#11.6 NOREF#22.7 Q4.1
VIN_5V_1: NOREF#4.1 NOREF#5.7 NOREF#14.1 NOREF#18.6
BAT: C49.2 IC7.5 NOREF#12.1 Q4.3
CHIP_EN: K1.2 R56.2 U1.7
G01: NOREF#27.8 RrA.1
G01-1: NOREF#13.8 NOREF#25.1
G02: NOREF#21.5 R65.1 RrB.1
G02-1: NOREF#7.5 NOREF#16.1
G03-1: NOREF#9.1 NOREF#15.2 NOREF#23.1
GPIO0: NOREF.1 U1.4 U17.2
GPIO1: R64.1 U1.5
GPIO2: R62.1 RrA.6 U1.6
GPIO3: R63.1 RrB.6 U1.8
GPIO4: R65.2 U1.9
GPIO5: U1.10
GPIO6: RrA.4 RrB.4 U1.12
GPIO7: RrA.5 RrB.5 U1.13
GPIO8: U1.14
GPIO9/BOOT: K2.2 R61.2 U1.15
GPIO10: U1.16
GPIO18/USB_DN: NOREF#17.4 U1.25
GPIO19/USB_DP: NOREF#19.3 U1.26
GPIO20/U0RXD: U1.27
GPIO21/U0TXD: U1.28
USBD+: NOREF#8.3 NOREF#24.1
USBD-: NOREF#10.1 NOREF#20.4
$1N988: C61.2 L2.2 X1.1
$1N989: L2.1 U1.30
$1N991: ANT2.1 L1.1 U1.1
$1N995: C62.1 U1.29 X1.3
$2N303: C64.2 D5.1 Q4.2 U16.3
$2N532: IC7.7 R28.1
$2N535: IC7.2 R26.2
$2N537: LED10.1 R28.2
$3N2118: LED11.1 R64.2

Pads without a net: IC7 1 6 9; RrA 7; RrB 7; U1 19 20 21 22 23 24

## Via types
v1: diameter 0.61, hole 0.305, Top Layer to Bottom Layer, 76 vias
v2: diameter 0.51, hole 0.305, Top Layer to Bottom Layer, 8 vias

## Routing (per net, layer and track width the routed paths; a pad name or vN(x,y) marks a point on that pad's centre or on a via; arc(x,y) is an arc through that point)
3V3: length 80.4
  Top Layer w0.254: v1(12.15,22.18) 12.11,22.14 U1.2 U1.3 ; 5.95,8.57 6.63,8.57 6.88,8.32 6.88,7.6 ; 5.95,8.57 2.88,8.57 2.62,8.32 RrB.2 ; 5.95,8.57 5.95,8.82 v1(5.69,9.08) ; R62.2 5.29,22.8 5.3,22.79 ; R62.2 4.35,23.83 v1(4.28,23.75) ; R62.2 6.29,23.83 R63.2 ; R56.1 4.32,22.79 5.3,22.79 ; 5.3,22.79 C28.1 ; 5.3,22.79 C63.1 ; U1.11 8.03,19.23 7.81,19.44 v1(7.51,19.44) 6.75,19.44 C56.2 5.15,17.84 4.32,17.84 ; 13.34,19.99 U1.31 ; 13.34,19.99 14.07,19.99 v1(14.09,19.97) ; 13.34,19.99 U1.32 ; U17.1 10.69,24.74 C66.2 9.03,24.6 v1(8.32,24.6) ; C57.2 6.85,13.92 C59.2 7.4,15.46 8.97,15.46 v1(9.11,15.32) ; 9.12,15.61 9.11,15.62 U1.17 ; C58.1 16.24,11.55 v1(16.24,11) 16.88,10.36 LED11.2
  Top Layer w0.508: v1(15.19,10.21) 14.96,10.21 U16.2 C65.2
  电源 w0.254: v1(15.19,10.21) 12.9,7.91 6.86,7.91 v1(5.69,9.08)
  电源 w0.508: 9.33,23.99 9.09,23.75 v1(4.28,23.75) ; 9.33,23.99 10.52,22.81 ; 9.33,23.99 8.72,24.6 v1(8.32,24.6) ; v1(15.19,10.21) 15.5,10.21 16.25,10.96 ; 12.93,15.96 9.75,15.96 v1(9.11,15.32) 9.11,19.36 ; 12.93,15.96 14.99,15.96 16.25,14.7 16.25,11.39 16.24,11.38 v1(16.24,11) ; 12.93,15.96 13.19,15.7 v1(13.19,15.3) ; 9.11,19.36 9.03,19.44 v1(7.51,19.44) ; 9.11,19.36 9.11,21.1 ; 9.11,21.1 10.24,19.97 v1(14.09,19.97) ; 9.11,21.1 9.11,21.4 10.52,22.81 ; 10.52,22.81 11.53,22.81 v1(12.15,22.18)
GND: length 21.4
  Top Layer w0.254: v1(14.37,6.47) 14.37,7.02 U16.1 14.23,7.37 16.1,9.24 C65.1 ; 3.28,7.6 3.28,6.66 v1(2.96,6.34) 0.93,6.34 0.48,6.79 0.48,8.53 RrB.8 ; R26.1 10.03,13.07 10.03,13.01 10.01,12.99 10.01,11.93 10.59,11.34 IC7.3 ; 8.98,6.34 8.98,4.01 ; RrA.8 6.24,9.47 7.53,8.17 RrA.3
  vias: v1(0.67,11.24) v1(0.69,9.61) v1(1.15,15.75) v1(1.18,14.52) v1(4.35,24.78) v1(4.29,19.59) v1(4.88,9.38) v1(5.17,6.9) v1(5.74,21.22) v1(6.6,12.14) v1(8.22,14.71) v1(11.3,17.04) v1(12.26,15.05) v1(12.91,21.71) v1(13.36,22.37) v1(14.03,22.72) v1(14.3,20.71) v1(14.73,25.23) v1(14.73,24.45) v1(14.73,23.67) v1(14.73,22.9) v1(14.81,14.91) v1(15,21.03) v1(15.78,21.03) v1(15.9,24.98) v1(16.56,21.03) v1(16.68,24.98) v1(17.34,21.03)
VIN_5V: length 27.9
  Top Layer w0.254: IC7.4 10.92,10.17 ; Q4.1 10.4,14.44 v1(10.57,14.61) ; LED10.2 17.32,7.33 v1(17.32,7.68) ; 10.89,10.14 11.33,9.69 D5.2 ; v1(13.19,13.19) 13.19,12.61 IC7.8
  电源 w0.254: v1(17.32,7.68) 16.79,7.15 v1(11.48,7.15) ; v1(7.72,8.84) 7.72,9.47 8.38,10.13 10.89,10.13 v1(11.35,9.67) 13.19,11.51 v1(13.19,13.19)
  Bottom Layer w0.254: NOREF#22.7 NOREF#11.6 ; v1(11.48,7.15) 11.48,9.54 v1(11.35,9.67) ; v1(10.57,14.61) 11.99,13.19 v1(13.19,13.19)
  Bottom Layer w0.508: v1(7.72,8.84) 7.72,7.46 7.69,7.43
VIN_5V_1: length 8.7
  Top Layer w0.254: 9.87,2.3 NOREF#5.7 ; 9.87,2.3 9.87,2.04 ; 9.87,2.3 v2(9.87,3.23) ; 9.87,2.04 NOREF#18.6 ; 9.87,2.04 v2(9.87,0.59)
  Top Layer w0.508: v2(11.2,0.6) 11.19,0.59 v2(9.87,0.59) ; v2(11.2,3.24) 11.19,3.23 v2(9.87,3.23)
  Bottom Layer w0.508: v2(9.87,3.23) 11.19,3.23 v2(11.2,3.24) ; v2(9.87,0.59) 11.19,0.59 v2(11.2,0.6)
BAT: length 22.4
  Top Layer w0.254: v1(13.17,14.01) 12.93,14.01 12.45,13.53 ; Q4.3 9.54,13.03 9.41,13.16 v1(9.15,13.16) ; v1(13.96,10.47) 13.59,10.84 IC7.5
  电源 w0.508: v1(13.96,10.47) 14.48,10.47 14.48,10.5 15.49,11.51 15.49,13.45 14.98,13.96 13.94,13.96 13.89,14.01 v1(13.17,14.01) 13.06,13.9 9.89,13.9 v1(9.15,13.16) 9.12,13.19 5.35,13.19 v1(3.06,15.48)
  Bottom Layer w0.508: v1(3.06,15.48) 2.7,15.84 NOREF#12.1
CHIP_EN: length 9.8
  Top Layer w0.254: 4.22,21.81 4.23,21.8 v1(4.23,21.01) ; 4.22,21.81 R56.2 ; 4.22,21.81 K1.2 ; U1.7 9.61,21.34 9.29,21.66 7.91,21.66 7.62,21.95 v1(7.62,22.69)
  Bottom Layer w0.254: v1(7.62,22.69) 5.91,22.69 v1(4.23,21.01)
G01: length 2
  Top Layer w0.254: v1(6,6.85) 6.24,7.09 RrA.1
  Bottom Layer w0.254: v1(6,6.85) 6.38,6.85 NOREF#27.8
G01-1: length 6.7
  Top Layer w0.254: v2(14.73,1.94) 14.71,1.92 NOREF#13.8
  Bottom Layer w0.254: NOREF#25.1 12.11,1.95 14.72,1.95
G02: length 28.1
  Top Layer w0.254: RrB.1 2.01,7.64 v1(2.01,8.67) ; v1(4.69,20.27) 4.88,20.46 R65.1 ; v1(7.78,11.94) 7.78,11.62 8.79,10.61 8.79,9.22 v1(8.48,8.91)
  电源 w0.254: v1(4.69,20.27) 5.13,19.83 5.13,19.13 4.28,18.28 4.28,17.08 5.03,16.33 v1(5.03,15.93)
  Bottom Layer w0.254: NOREF#21.5 8.46,8.89 v1(8.48,8.91) 8.48,11.09 8.51,11.12 8.51,12.45 v1(5.03,15.93) ; v1(7.78,11.94) 7.69,11.86 7.69,11.53 6.18,10.02 3.36,10.02 v1(2.01,8.67)
G02-1: length 1.5
  Top Layer w0.254: v2(8.96,3.25) 9.25,2.96 NOREF#7.5
G03-1: length 10.1
  Top Layer w0.3: v1(3.23,2) 5.84,2 6.58,2.74 7.45,2.74 ; 7.75,1.47 7.75,2.44 7.45,2.74 ; 7.25,1.36 7.25,2.54 7.45,2.74
  Bottom Layer w0.3: v1(3.23,2) NOREF#23.1
GPIO0: length 12
  Top Layer w0.254: U17.2 11.11,22.44 U1.4
  Bottom Layer w0.254: v1(11.12,21.85) 9.53,23.44 5.83,23.44 5.44,23.05 4.15,23.05 3,24.2 3,24.73
GPIO1: length 17
  Top Layer w0.254: U1.5 10.61,21.53 10.54,21.61 10.54,21.62 9.29,22.86 v1(9.02,22.86) ; R64.1 16.98,13.65 v1(17.16,13.83)
  Bottom Layer w0.254: v1(17.16,13.83) 14.8,13.83 14.13,14.5 14.13,16.35 13.05,17.43 13.05,18.44 9.02,22.47 v1(9.02,22.86)
GPIO2: length 25.7
  Top Layer w0.254: RrA.6 7.53,10.78 7.22,11.1 5.87,11.1 v1(5.65,10.87) ; U1.6 10.11,21.48 9.44,22.15 8.61,22.15 v1(8.39,22.38) 8.22,22.55 8.22,23.23 7.61,23.84 7.61,24.62 6.83,25.41 6,25.41 R62.1 ; v1(6.59,16.25) 6.23,16.25 5.44,15.46 5.44,12.87 v1(5.05,12.48)
  Bottom Layer w0.254: v1(6.59,16.25) 7.17,16.83 7.17,17.77 6.39,18.54 6.39,21.39 7,21.99 8.14,21.99 8.39,22.24 v1(8.39,22.38) ; v1(5.05,12.48) 5.05,11.85 5.65,11.26 v1(5.65,10.87)
GPIO3: length 20.9
  Top Layer w0.254: U1.8 7.79,20.96 v1(7.57,21.18) 7.04,21.71 7.04,24.44 6.79,24.7 R63.1 ; v1(7.53,16.18) 7.01,15.66 6.15,15.66 5.84,15.35 5.84,12.44 5.3,11.9 4.37,11.9 3.28,10.81 3.28,10.02
  Bottom Layer w0.254: v1(7.57,21.18) 7.1,21.18 6.75,20.83 6.75,18.69 7.53,17.92 7.53,16.36 7.53,16.36 v1(7.53,16.18)
GPIO4: length 2
  Top Layer w0.254: U1.9 7.33,20.23 7.1,20.46 R65.2
GPIO6: length 24.2
  Top Layer w0.254: U1.12 6.89,18.73 5.58,17.42 v1(5.55,17.42) ; RrA.4 8.19,7.04 7.41,6.27 4.65,6.27 v1(4.37,6.55) 3.93,6.99 RrB.4
  Bottom Layer w0.254: v1(4.37,6.55) 3.93,6.55 2.49,7.98 1.87,7.98 1.36,8.49 1.36,8.85 3.86,11.35 3.86,16.24 5.03,17.42 v1(5.55,17.42)
GPIO7: length 16.1
  Top Layer w0.254: U1.13 7.33,18.23 v1(6.52,17.42) ; RrB.5 3.93,10.6 v1(4.61,11.28) 4.78,11.45 7.44,11.45 8.19,10.71 RrA.5
  Bottom Layer w0.254: v1(6.52,17.42) 5.9,16.81 4.93,16.81 4.35,16.23 4.35,11.54 v1(4.61,11.28)
GPIO9/BOOT: length 5.9
  Top Layer w0.254: U1.15 7.62,17.23 7.22,16.83 4.47,16.83 R61.2 4.27,16.93 K2.2
GPIO18/USB_DN: length 14.1
  Top Layer w0.254: U1.25 13.77,16.3 13.77,13.04 14.02,12.79 v1(14.02,12.01)
  Bottom Layer w0.254: NOREF#17.4 9,7.47 9,8.6 9.07,8.67 9.07,11.26 9.58,11.77 13.78,11.77 v1(14.02,12.01)
GPIO19/USB_DP: length 15.6
  Top Layer w0.254: v1(14.72,12.94) 14.14,13.52 14.14,16.85 13.76,17.23 U1.26
  Bottom Layer w0.254: v1(14.72,12.94) 14.95,12.71 14.95,12.09 14.27,11.41 9.72,11.41 9.47,11.16 9.47,7.44 NOREF#19.3
USBD+: length 1.8
  Top Layer w0.254: v2(8.03,3.23) 8.25,3.01 8.25,1.47
USBD-: length 4
  Top Layer w0.254: v2(6.69,0.61) 6.86,0.61 7.04,0.43 8.46,0.43 8.75,0.72 8.75,1.56
  Bottom Layer w0.254: NOREF#10.1 7.27,0.61 v2(6.69,0.61)
$1N988: length 2.5
  Top Layer w0.254: 15.38,17.68 arc(15.56,17.94) 15.62,18.24 L2.2 16.29,19.31 arc(16.34,19.32) C61.2
$1N989: length 1.3
  Top Layer w0.254: U1.30 14.4,19.23 arc(14.51,19.25) L2.1
$1N991: length 4
  Top Layer w0.254: U1.1 12.62,20.96 arc(13.59,21.12) 14.45,21.59 arc(14.58,21.7) 14.71,21.82 arc(15.22,22.16) 15.82,22.28 ANT2.1
$1N995: length 8.2
  Top Layer w0.254: C62.1 16.74,14.42 v1(16.97,14.65) 16.97,15.45 X1.3 ; U1.29 13.9,18.73 v1(14.14,18.49)
  Bottom Layer w0.254: v1(16.97,14.65) 16.97,16.12 14.59,18.49 v1(14.14,18.49)
$2N303: length 10.9
  Top Layer w0.254: U16.3 11.15,8.32 D5.1 10.18,8.2 9.48,8.9 9.48,9.24 9.15,9.58 9.15,10.75 8.45,11.45 8.45,13.49 ; 8.45,13.49 8.45,13.72 9.04,14.31 Q4.2 ; 8.45,13.49 C64.2
$2N532: length 6.4
  Top Layer w0.254: IC7.7 13.36,11.84 13.79,11.41 14.84,11.41 16.66,9.6 R28.1
$2N535: length 2.6
  Top Layer w0.254: IC7.2 10.85,11.91 10.53,11.91 10.36,12.08 10.36,12.61 11.23,13.47 R26.2
$2N537: length 1.1
  Top Layer w0.254: LED10.1 15.68,7.86 R28.2
$3N2118: length 0.9
  Top Layer w0.254: R64.2 16.98,11.52 LED11.1

## Copper pours and planes (outline as drawn; the poured copper is in the pictures)
GND on Top Layer: -7.26,30.15 35.86,30.15 35.86,-3.34 -7.26,-3.34
GND on Bottom Layer: -11.4,28.72 33.23,28.72 33.23,-6.58 -11.4,-6.58
GND on 电源: -17.41,30.03 35.2,30.03 35.2,-1.88 -17.41,-1.88
GND on 地: -11.76,32.81 31.81,32.81 31.81,-3.16 -11.76,-3.16
VIN_5V_1 on Top Layer: 9.71,3.28 10.32,3.28 10.32,0.36 9.71,0.36

Small or netless copper shapes (teardrops, artwork), in the pictures only: 128 on Top Layer, 38 on Bottom Layer, 24 on 电源

## Text on the board
Bottom Silkscreen Layer: GND | BAT | WAKE | GAVV_C3 | HW:V2.4 | .
Top Silkscreen Layer: .
